# Altium project Ch340.PrjPcb
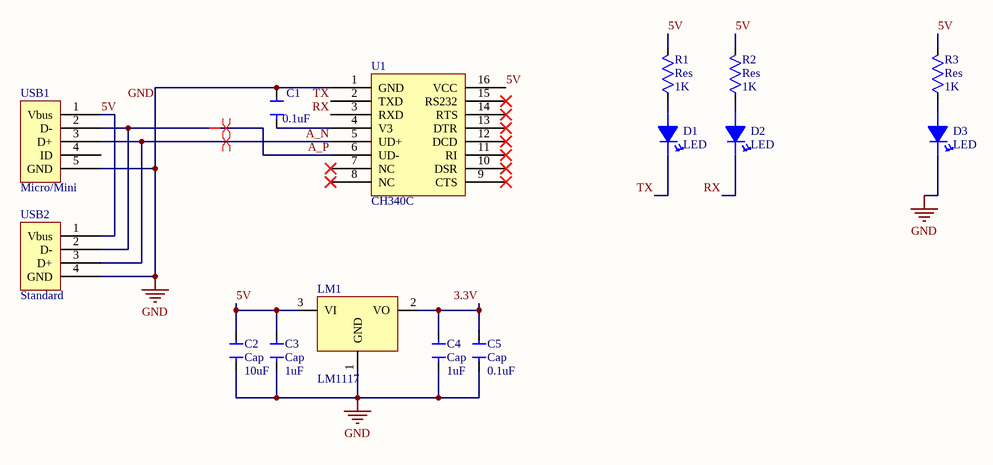
[diagram p0: Sheet.SchDoc]
1 sheet, 15 parts. Net scope: global (net labels, ports and power ports of the same name join across sheets).
Board file: PCB.PcbDoc

## Sheet Sheet.SchDoc
size A4

### Parts
C1  value 0.1uF  [Cap_0603]  (hidden comment: Cap)
C2  Cap  value 10uF  [Cap_0603]
C3  Cap  value 1uF  [Cap_0603]
C4  Cap  value 1uF  [Cap_0603]
C5  Cap  value 0.1uF  [Cap_0603]
D1  LED  [SMD-0603_LED]
D2  LED  [SMD-0603_LED]
D3  LED  [SMD-0603_LED]
LM1  LM1117  [SOT-223]
R1  Res  value 1K  [RES_0603]
R2  Res  value 1K  [RES_0603]
R3  Res  value 1K  [RES_0603]
U1  CH340C  [SOP127P600X265-16N]
USB1  Micro/Mini  [USB_Mini-B_S_SMT]
USB2  Standard  [USB_Type-A_P_Thru-Hole]

### Nets
GND: C1.1 C2.2 C3.2 C4.2 C5.2 D3.2 LM1.1(GND) U1.1(GND) USB1.5(GND) USB2.4(GND)
3.3V: C4.1 C5.1 LM1.2(VO)
5V: C2.1 C3.1 LM1.3(VI) R1.1 R2.1 R3.1 U1.16(VCC) USB1.1(Vbus) USB2.1(Vbus)
A_N: U1.5(UD+) USB1.3(D+) USB2.3(D+)
A_P: U1.6(UD-) USB1.2(D-) USB2.2(D-)
RX: D2.2 U1.3(RXD)
TX: D1.2 U1.2(TXD)
NetC1_2: C1.2 U1.4(V3)
NetD1_1: D1.1 R1.2
NetD2_1: D2.1 R2.2
NetD3_1: D3.1 R3.2

Not connected (* = marked no-connect by the designer): U1 7(NC)* 8(NC)* 9(CTS)* 10(DSR)* 11(RI)* 12(DCD)* 13(DTR)* 14(RTS)* 15(RS232)*; USB1 4(ID)

### Layout directives
differential pair: A_N, A_P

### Library data of the parts
USB1 = USB2
USB2 = USB1